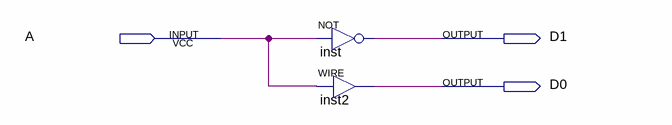
[diagram p0: schematic sheet]
// Quartus schematic DECODE1_2.bdf as structural Verilog: 2 symbols, 3 pins
module DECODE1_2 (
  input  A,
  output D1,
  output D0
);

  not inst (D1, A);
  assign D0 = A;  // WIRE inst2
endmodule
